# EasyEDA Pro project ax08_duplicate.eprj, schematic condition
Board Name: condition; Create Date: 2025-06-19; Page Name: condition; Project Name: ax08_duplicate; Schematic Name: condition; Update Date: 2025-06-19; Company: EasyEDA.com; Page Size: A4; Version: V1.0
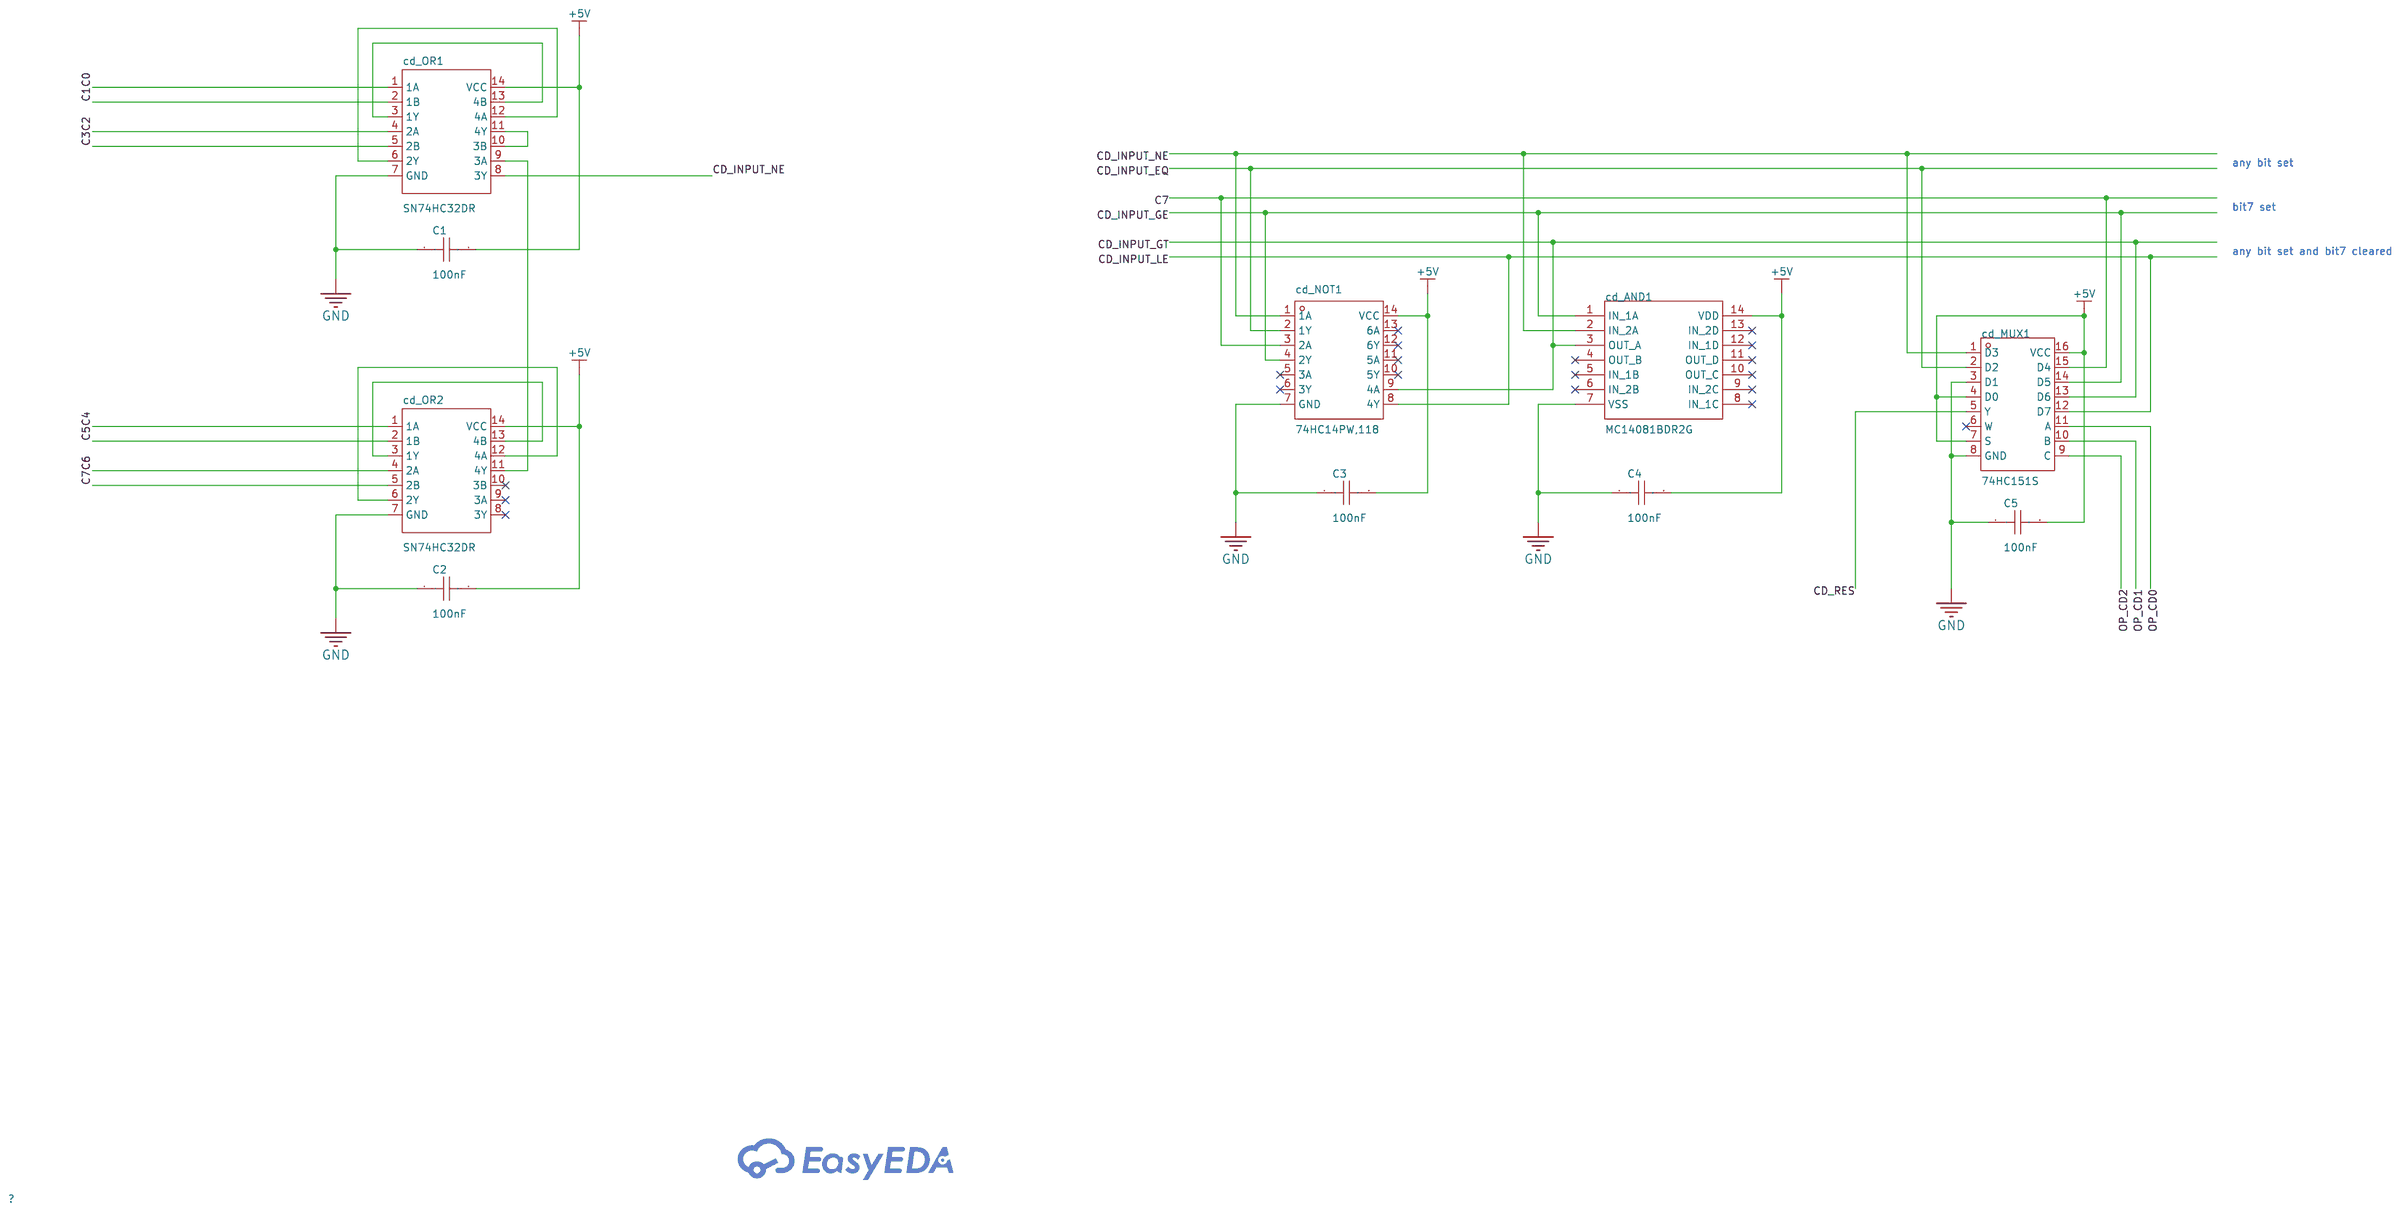
[diagram p4: schematic sheet]

## Parts
C1  100nF  [C0805]
C2  100nF  [C0805]
C3  100nF  [C0805]
C4  100nF  [C0805]
C5  100nF  [C0805]
cd_AND1  MC14081BDR2G  [SOIC-14_L8.7-W3.9-P1.27-LS6.0-BL]
cd_MUX1  74HC151S  [SOP-16_L10.2-W3.9-P1.27-LS6.0-BL]
cd_NOT1  74HC14PW,118  [TSSOP-14_L5.0-W4.4-P0.65-LS6.4-BL]
cd_OR1  SN74HC32DR  [SOIC-14_L8.7-W3.9-P1.27-LS6.0-BL]
cd_OR2  SN74HC32DR  [SOIC-14_L8.7-W3.9-P1.27-LS6.0-BL]

## Library data of the parts
C1-C5 = CC0805KRX7R9BB104: LCSC Part Name: 100nF ±10% 50V; Supplier Part: C49678; Manufacturer: YAGEO(国巨); Supplier Footprint: 0805; JLCPCB Part Class: Basic Part; Datasheet: https://atta.szlcsc.com/upload/public/pdf/source/20180224/C181747_15194369449651363981.pdf; Supplier: LCSC; Tolerance: ±10%
cd_AND1 = MC14081BDR2G: Supplier Part: C52342; Manufacturer: onsemi(安森美); Supplier Footprint: SOIC-14; JLCPCB Part Class: Extended Part; Datasheet: https://atta.szlcsc.com/upload/public/pdf/source/20191203/C463300_6D19168778DBD465A86B239F140F6B23.pdf; Supplier: LCSC; Logic Gate Type: With Door; Number of Channels: 4; Supply Voltage: 3V~18V; Quiescent Current (Max): 1uA; Sink Current: 8.8mA; Source Current: 8.8mA; High Level Range (VIH): 3.5V~11V; Low Level Range (VIL): 1.5V~4V; Series: 4000BSeries; Propagation Delay Time: 100ns@15V,50pF; Operating Temperature: -55℃~+125℃
cd_MUX1 = 74HC151S: Supplier Part: C22357609; Manufacturer: GR(国睿); Supplier Footprint: SOP-16; JLCPCB Part Class: Extended Part; Datasheet: https://atta.szlcsc.com/upload/public/pdf/source/20240312/E9AF893ECEDE51F2B4127B42A4881093.pdf; Supplier: LCSC; Type: Multiplexers; Voltage Supply Source: Single supply; Supply Voltage: 2V~6V; Number of lines: 1~8; Sink Current: 7.8mA; Source Current: 7.8mA
cd_NOT1 = 74HC14PW,118: Input Type:Schmitt Trigger Supply Voltage(Single):2V~6V Supply Voltage(Single):2V~6V Supply Current (Max):2uA Number of Circuits:6 Number of Inputs:1 Sink Current:5.2mA Source Current:5.2mA High level range (VIH):1.5V~4.2V High level range (VIH):1.5V~4.2V; LCSC Part Name: 六路施密特触发反相器; Supplier Part: C5606; Manufacturer: Nexperia(安世); Supplier Footprint: TSSOP-14; JLCPCB Part Class: Extended Part; Datasheet: https://atta.szlcsc.com/upload/public/pdf/source/20170918/C131315_1505726904049976307.pdf; Supplier: LCSC; Input Type: Schmitt Trigger; Supply Voltage(Single): 2V~6V; Supply Current (Max): 2uA; Number of Circuits: 6; Number of Inputs: 1; Sink Current: 5.2mA; Source Current: 5.2mA; High level range (VIH): 1.5V~4.2V; Low level range (VIL): 300mV~1.2V; Max Propagation Delay: 21ns@6V,50pF; Series: 74HCSeries; Operating Temperature: -40℃~+125℃
cd_OR1 cd_OR2 = SN74HC32DR: Supplier Part: C6838; Manufacturer: TI(德州仪器); Supplier Footprint: SOIC-14; JLCPCB Part Class: Extended Part; Datasheet: https://www.ti.com/cn/lit/gpn/sn74hc32; Supplier: LCSC; Logic Type: OR Gate; Number of Channels: 4; Voltage - Supply: 2V~6V; Quiescent Current: 2uA; Current - Output Low(IOL): 5.2mA; Current - Output High(IOH): 5.2mA; Input Logic Level - High: 1.5V~4.2V; Input Logic Level - Low: 500mV~1.8V; Series: 74HCSeries; Propagation Delay: 17ns@6V,50pF; Operating Temperature: -40℃~+85℃

## Nets
+5V: C1.2 C2.2 C3.2 C4.2 C5.2 cd_AND1.14(VDD) cd_MUX1.4(D0) cd_MUX1.7(S) cd_MUX1.16(VCC) cd_NOT1.14(VCC) cd_OR1.14(VCC) cd_OR2.14(VCC)
GND: C1.1 C2.1 C3.1 C4.1 C5.1 cd_AND1.7(VSS) cd_MUX1.3(D1) cd_MUX1.8(GND) cd_NOT1.7(GND) cd_OR1.7(GND) cd_OR2.7(GND)
C0: cd_OR1.1(1A)
C1: cd_OR1.2(1B)
C2: cd_OR1.4(2A)
C3: cd_OR1.5(2B)
C4: cd_OR2.1(1A)
C5: cd_OR2.2(1B)
C6: cd_OR2.4(2A)
C7: cd_MUX1.15(D4) cd_NOT1.3(2A) cd_OR2.5(2B)
CD_INPUT_EQ: cd_MUX1.2(D2) cd_NOT1.2(1Y)
CD_INPUT_GE: cd_AND1.1(IN 1A) cd_MUX1.14(D5) cd_NOT1.4(2Y)
CD_INPUT_GT: cd_AND1.3(OUT A) cd_MUX1.13(D6) cd_NOT1.9(4A)
CD_INPUT_LE: cd_MUX1.12(D7) cd_NOT1.8(4Y)
CD_INPUT_NE: cd_AND1.2(IN 2A) cd_MUX1.1(D3) cd_NOT1.1(1A) cd_OR1.8(3Y)
CD_RES: cd_MUX1.5(Y)
OP_CD0: cd_MUX1.11(A)
OP_CD1: cd_MUX1.10(B)
OP_CD2: cd_MUX1.9(C)
$1N582: cd_OR1.3(1Y) cd_OR1.13(4B)
$1N593: cd_OR1.6(2Y) cd_OR1.12(4A)
$1N762: cd_OR2.3(1Y) cd_OR2.13(4B)
$1N768: cd_OR2.6(2Y) cd_OR2.12(4A)
$1N778: cd_OR1.10(3B) cd_OR1.11(4Y)
$1N808: cd_OR1.9(3A) cd_OR2.11(4Y)

Not connected (* = marked no-connect by the designer): cd_AND1 4(OUT B)* 5(IN 1B)* 6(IN 2B)* 8(IN 1C)* 9(IN 2C)* 10(OUT C)* 11(OUT D)* 12(IN 1D)* 13(IN 2D)*; cd_MUX1 6(W)*; cd_NOT1 5(3A)* 6(3Y)* 10(5Y)* 11(5A)* 12(6Y)* 13(6A)*; cd_OR2 8(3Y)* 9(3A)* 10(3B)*

## Notes on the sheet
- any bit set
- bit7 set
- any bit set and bit7 cleared
